# EAGLE schematic schematic1 (EAGLE 7.4.0)
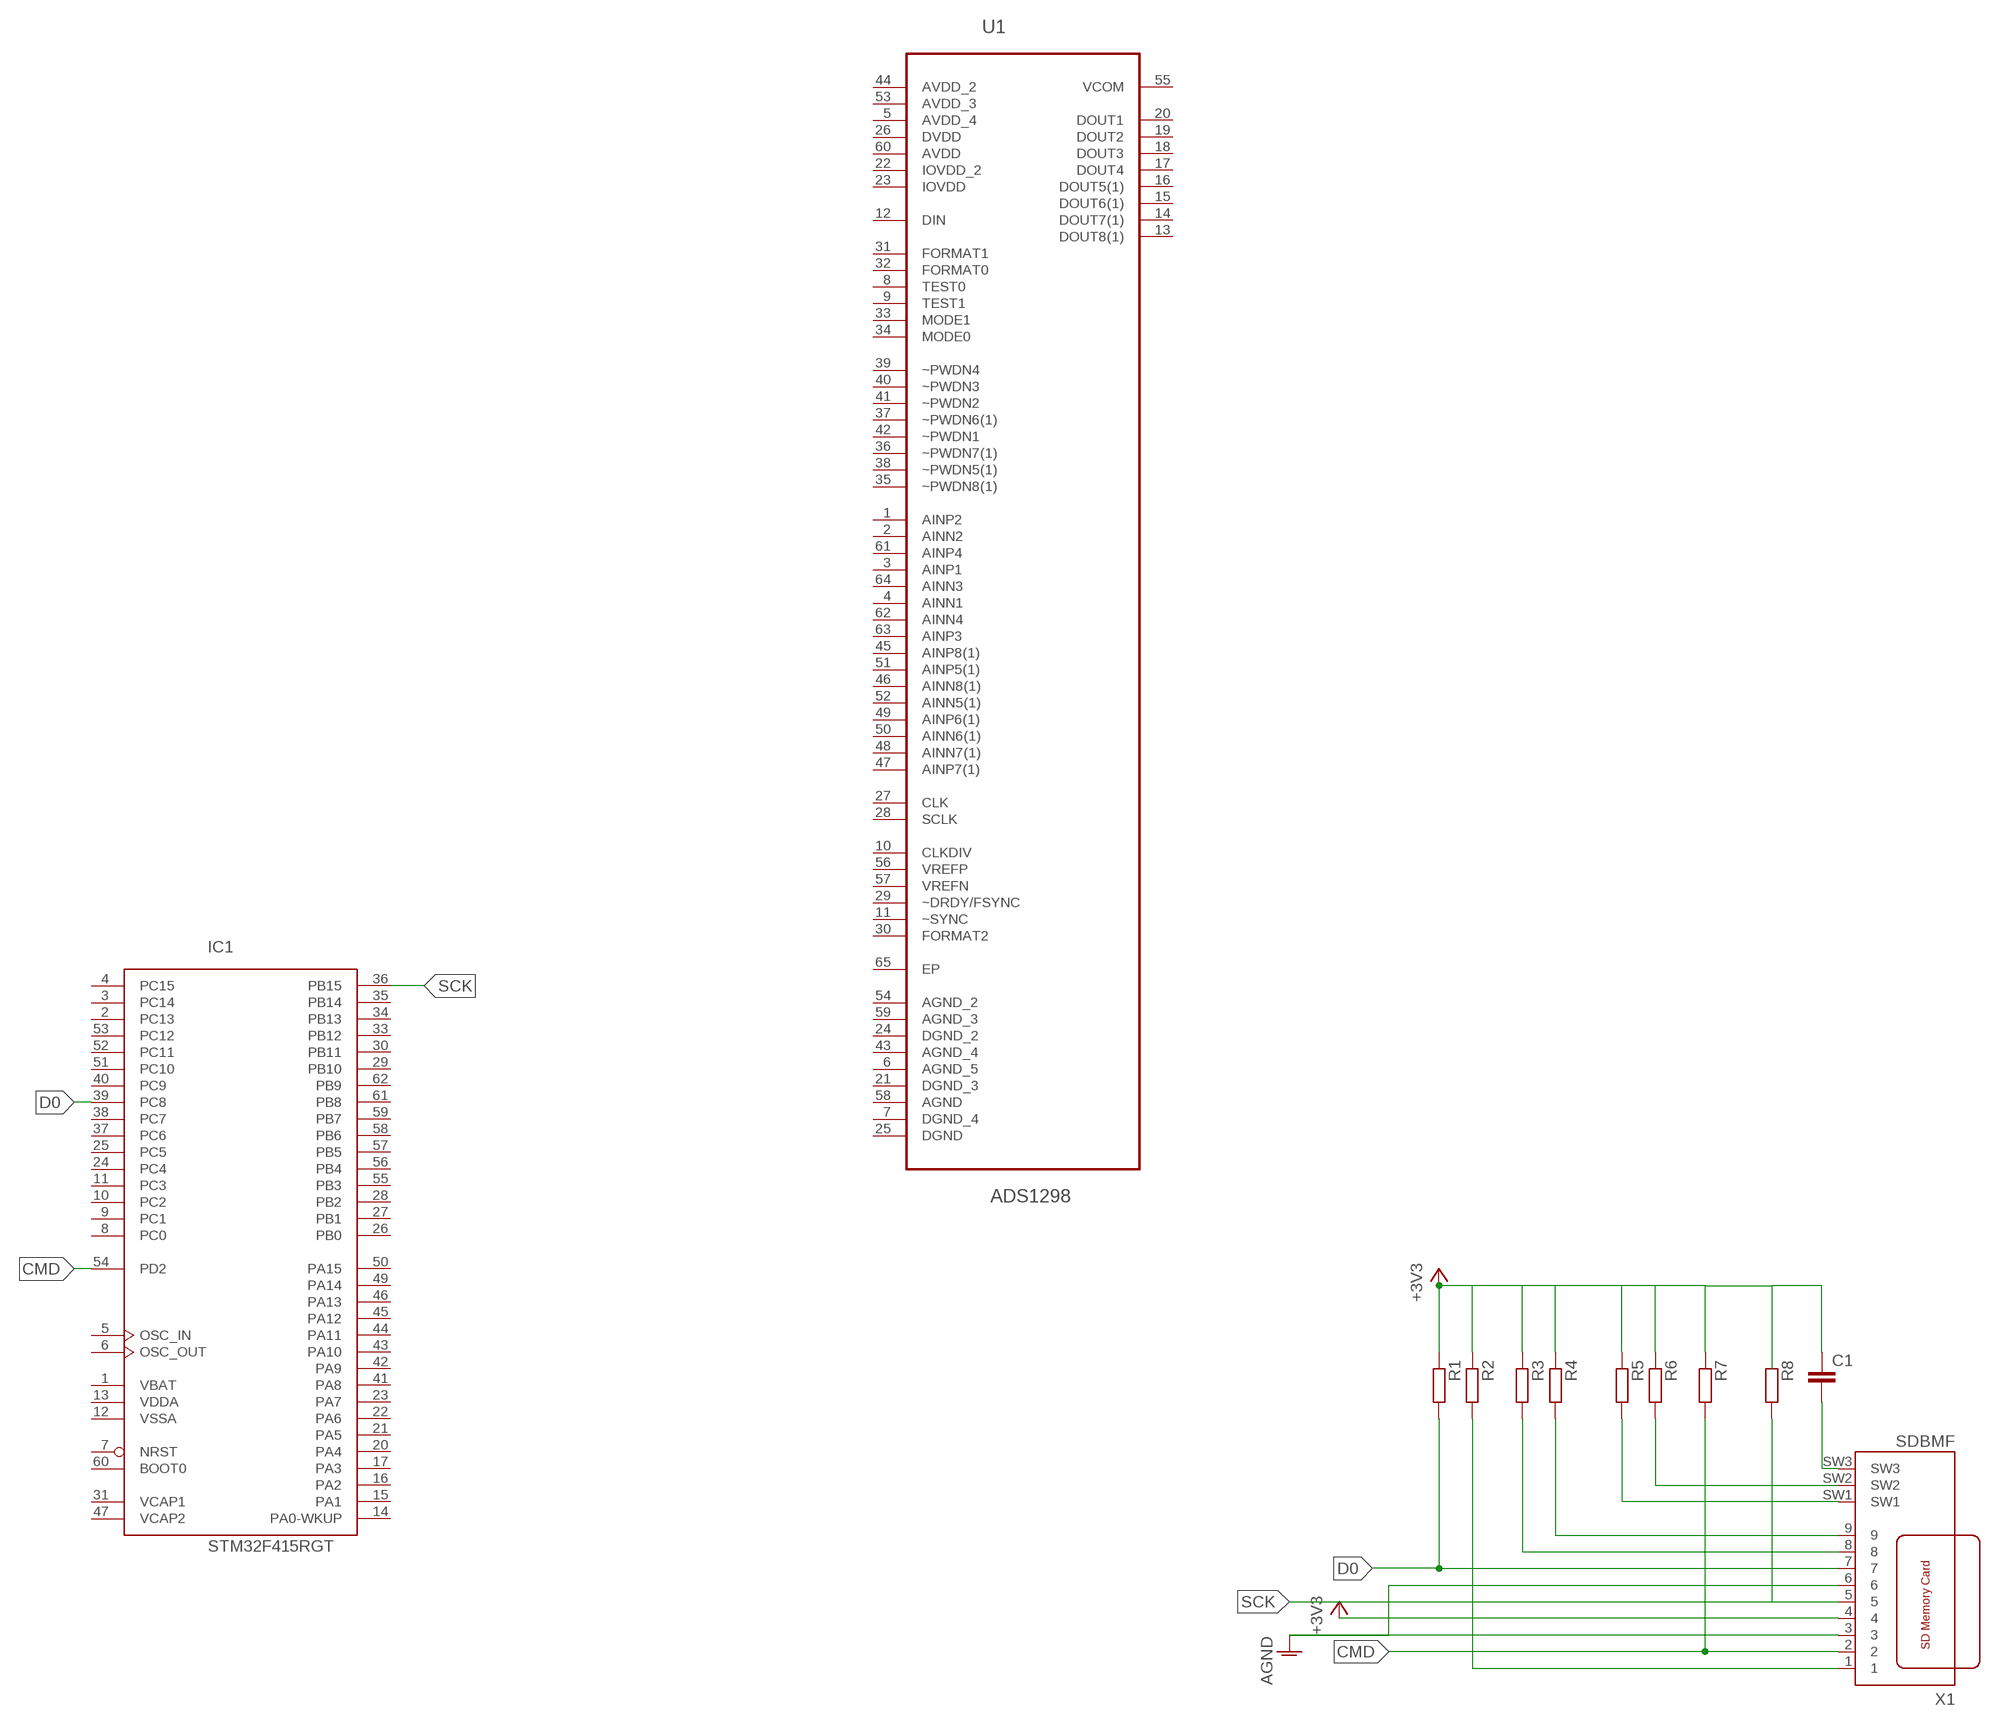
[diagram p0: schematic, sheet 1]

## Parts
C1  C-EUC1608  [C1608]
IC1  STM32F415RGT  [LQFP64]
R1  R-EU_M1406  [M1406]
R2  R-EU_M1406  [M1406]
R3  R-EU_M1406  [M1406]
R4  R-EU_M1406  [M1406]
R5  R-EU_M1406  [M1406]
R6  R-EU_M1406  [M1406]
R7  R-EU_M1406  [M1406]
R8  R-EU_M1406  [M1406]
U1  ADS1298  [QFP50P1200X1200X120-65N]
X1  SDBMF  [SDBMF-009XXBXX2]

## Nets
+3V3: C1.1 R1.1 R2.1 R3.1 R4.1 R5.1 R6.1 R7.1 X1.4
AGND: X1.3 X1.6
CMD: IC1.54(PD2) R7.2 X1.2
D0: IC1.39(PC8) R1.2 X1.7
N$1: R2.2 X1.1
N$2: R3.2 X1.8
N$3: R6.2 X1.SW2
N$4: R4.2 X1.9
N$5: R8.1
N$7: R5.2 X1.SW1
N$8: C1.2 X1.SW3
SCK: IC1.36(PB15) R8.2 X1.5
Unconnected: IC1.2(PC13) IC1.3(PC14) IC1.4(PC15) IC1.5(OSC_IN) IC1.6(OSC_OUT) IC1.7(NRST) IC1.8(PC0) IC1.9(PC1) IC1.10(PC2) IC1.11(PC3) IC1.14(PA0-WKUP) IC1.15(PA1) IC1.16(PA2) IC1.17(PA3) IC1.20(PA4) IC1.21(PA5) IC1.22(PA6) IC1.23(PA7) IC1.24(PC4) IC1.25(PC5) IC1.26(PB0) IC1.27(PB1) IC1.28(PB2) IC1.29(PB10) IC1.30(PB11) IC1.33(PB12) IC1.34(PB13) IC1.35(PB14) IC1.37(PC6) IC1.38(PC7) IC1.40(PC9) IC1.41(PA8) IC1.42(PA9) IC1.43(PA10) IC1.44(PA11) IC1.45(PA12) IC1.46(PA13) IC1.49(PA14) IC1.50(PA15) IC1.51(PC10) IC1.52(PC11) IC1.53(PC12) IC1.55(PB3) IC1.56(PB4) IC1.57(PB5) IC1.58(PB6) IC1.59(PB7) IC1.60(BOOT0) IC1.61(PB8) IC1.62(PB9) U1.1(AINP2) U1.2(AINN2) U1.3(AINP1) U1.4(AINN1) U1.6(AGND_5) U1.7(DGND_4) U1.8(TEST0) U1.9(TEST1) U1.10(CLKDIV) U1.11(~SYNC) U1.12(DIN) U1.13(DOUT8(1)) U1.14(DOUT7(1)) U1.15(DOUT6(1)) U1.16(DOUT5(1)) U1.17(DOUT4) U1.18(DOUT3) U1.19(DOUT2) U1.20(DOUT1) U1.21(DGND_3) U1.24(DGND_2) U1.25(DGND) U1.27(CLK) U1.28(SCLK) U1.29(~DRDY/FSYNC) U1.30(FORMAT2) U1.31(FORMAT1) U1.32(FORMAT0) U1.33(MODE1) U1.34(MODE0) U1.35(~PWDN8(1)) U1.36(~PWDN7(1)) U1.37(~PWDN6(1)) U1.38(~PWDN5(1)) U1.39(~PWDN4) U1.40(~PWDN3) U1.41(~PWDN2) U1.42(~PWDN1) U1.43(AGND_4) U1.45(AINP8(1)) U1.46(AINN8(1)) U1.47(AINP7(1)) U1.48(AINN7(1)) U1.49(AINP6(1)) U1.50(AINN6(1)) U1.51(AINP5(1)) U1.52(AINN5(1)) U1.54(AGND_2) U1.55(VCOM) U1.56(VREFP) U1.57(VREFN) U1.58(AGND) U1.59(AGND_3) U1.61(AINP4) U1.62(AINN4) U1.63(AINP3) U1.64(AINN3) U1.65(EP)

## Power pins joined to a net without a drawn wire
AVDD: U1.60(AVDD)
AVDD_2: U1.44(AVDD_2)
AVDD_3: U1.53(AVDD_3)
AVDD_4: U1.5(AVDD_4)
DVDD: U1.26(DVDD)
IOVDD: U1.23(IOVDD)
IOVDD_2: U1.22(IOVDD_2)
VBAT: IC1.1(VBAT)
VCAP1: IC1.31(VCAP1)
VCAP2: IC1.47(VCAP2)
VDD: IC1.19(VDD) IC1.32(VDD) IC1.48(VDD) IC1.64(VDD)
VDDA: IC1.13(VDDA)
VSS: IC1.18(VSS) IC1.63(VSS)
VSSA: IC1.12(VSSA)

## Library data of the parts
C1 = rcl:C-EU: CAPACITOR, European symbol
IC1 = micro-stm_v3:STM32F415R*T: ARM 32-bit Cortex™-M3 CPU 168 MHz maximum frequency 1024 Kbytes of Flash memory 192 kbytes of SRAM 51 GPIOs 1.8 to 3.6 V application supply
R1-R8 = rcl:R-EU_: RESISTOR, European symbol
U1 = Texas Instruments_By_element14_Batch_1:ADS1298: Analog-to-Digital Converters; MPN: ADS1278IPAPT; OC_FARNELL: 1603419; OC_NEWARK: 50M8811; PACKAGE: HTQFP-64; SUPPLIER: Texas Instruments
X1 = farnell:SDBMF: SD MEMORY CARD PUSH-PUSH WITH CONNECTOR TYPE B (BIG SWUÌTCH #3) KINGFONT PRECISION INDUSTIAL CO., LTD Source: http://www.farnell.com/datasheets/74273.pdf Best.-Nr.: 9186174 Hersteller: MULTICOMP Herstellerbez.: SDBMF-00915B0T2